# EAGLE design VIP (EAGLE 7.5.0)
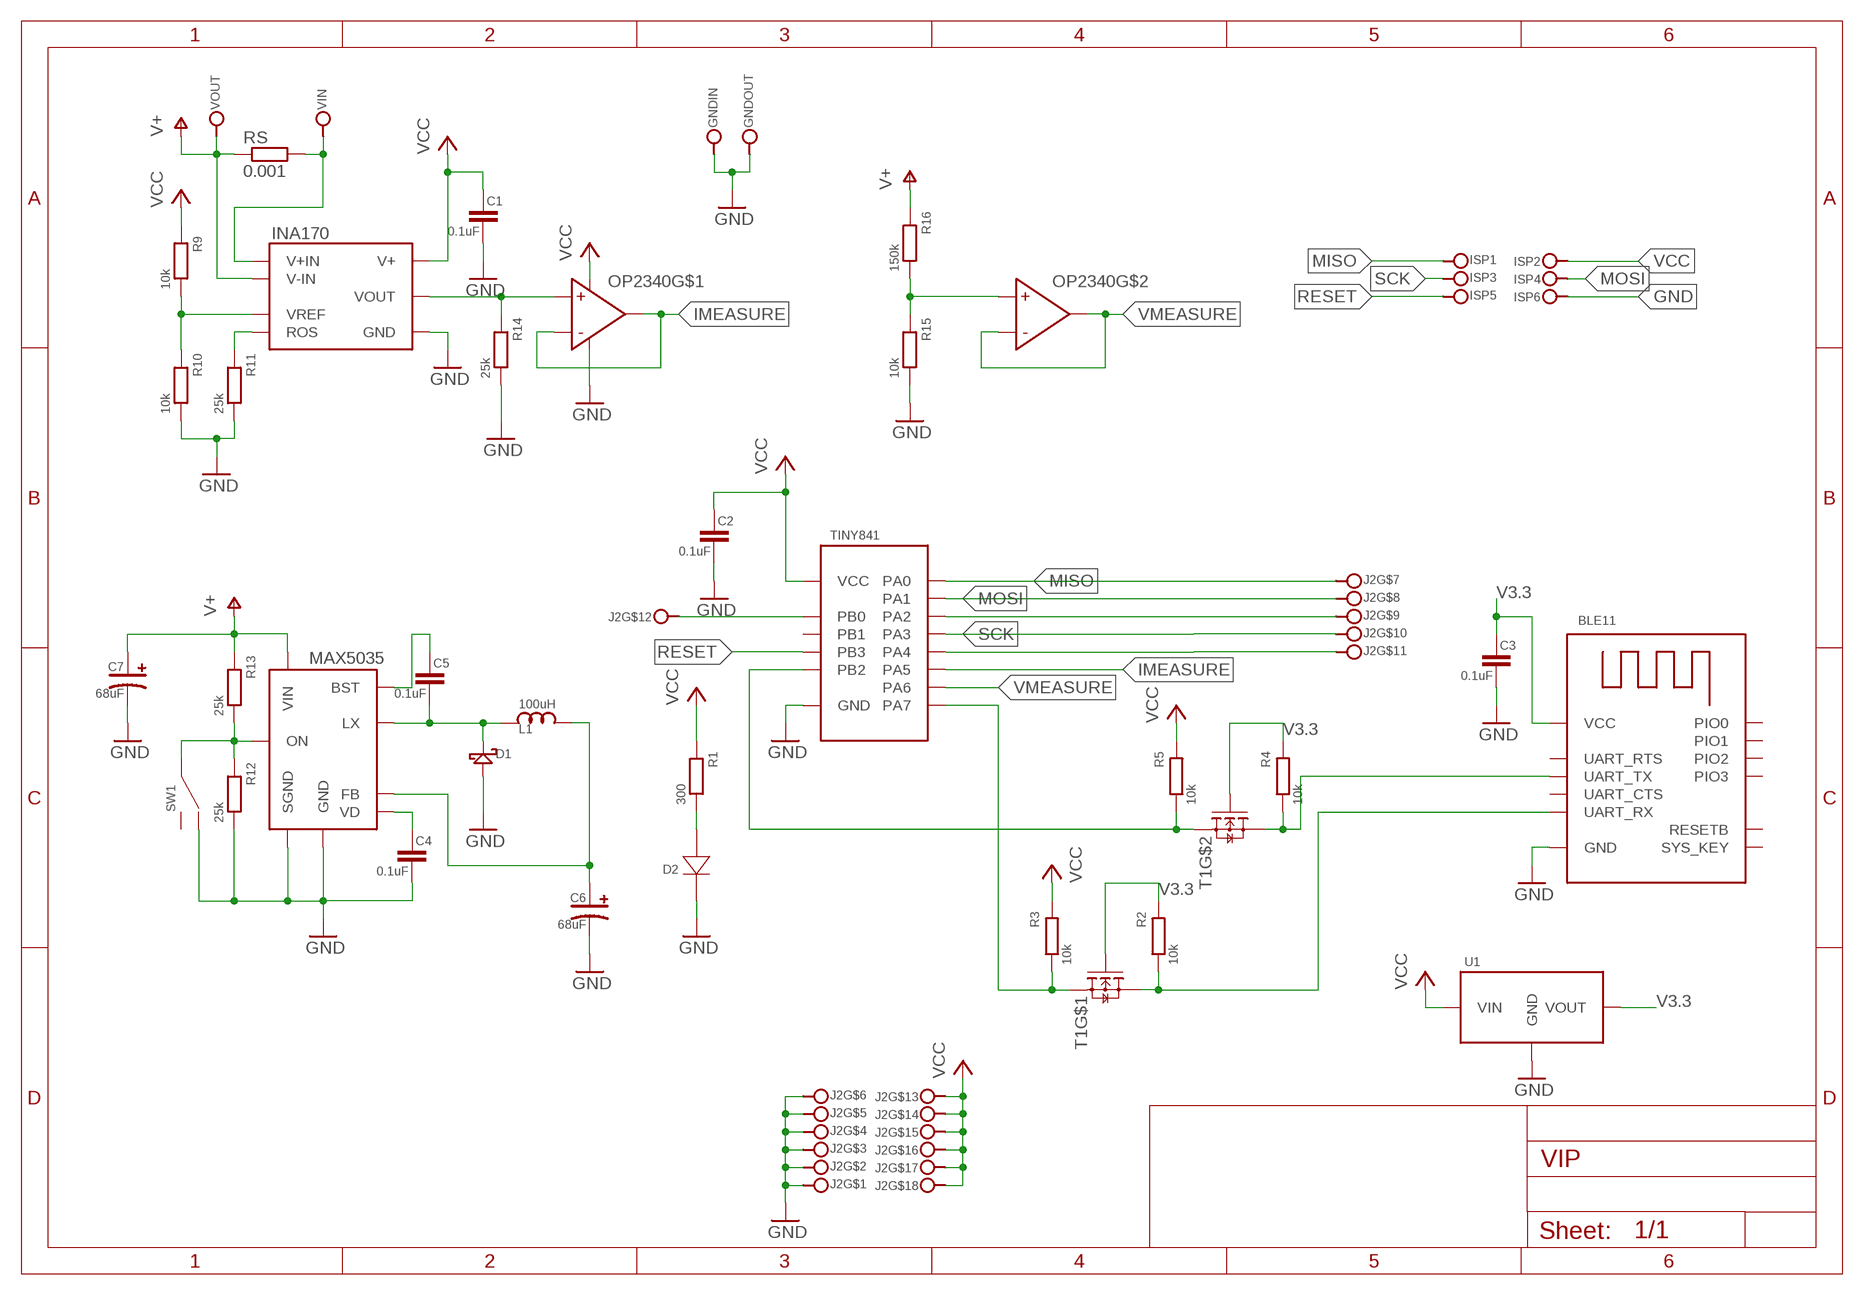
[diagram p0: schematic, sheet 1]

## Parts
BLE11  HM-17BLE  [HM17BLE]
C1  0.1uF  C_SMD  [0603L]
C2  0.1uF  C_SMD  [0603L]
C3  0.1uF  C_SMD  [0603L]
C4  0.1uF  C_SMD  [0603L]
C5  0.1uF  C_SMD  [0603L]
C6  68uF  ECAP_SMD6.3MM  [RAD6.3MM]
C7  68uF  ECAP_SMD12.5MM  [RAD12.5MM]
D1  SCHOTTKY  [DO-214AA]
D2  SINGLELEDKP-3216SRC-PRV  [LED3.2X1.6MM]
GNDIN  POWERTAB  [POWER8X10MM]
GNDOUT  POWERTAB  [POWER8X10MM]
INA170  INA170  [INA170]
ISP  CON254_6WAY254-2X3-EDGE  [CON254MM08_2X3_EDGE]
J2  CON254_18WAY3X6  [CON254MM08_3X6]
L1  100uH  L_SMD8040  [SRN8040]
MAX5035  MAX5035  [NSOIC-8]
OP2340  OPA2340  [SO-8]
R1  300  R_SMD  [0603L]
R2  10k  R_SMD  [0603L]
R3  10k  R_SMD  [0603L]
R4  10k  R_SMD  [0603L]
R5  10k  R_SMD  [0603L]
R9  10k  R_SMD  [0603L]
R10  10k  R_SMD  [0603L]
R11  25k  R_SMD  [0603L]
R12  25k  R_SMD  [0603L]
R13  25k  R_SMD  [0603L]
R14  25k  R_SMD  [0603L]
R15  10k  R_SMD  [0603L]
R16  150k  R_SMD  [0603L]
RS  0.001  R-EU_3921[1052METRIC]  [3921[1052METRIC]]
SW1  SWITCH-1P2T  [JS102011]
T1  2N7002  [SOT-563]
TINY841  ATTINY841  [SOIC14]
U1  L78L33A  [SOT-89]
VIN  POWERTAB  [POWER8X10MM]
VOUT  POWERTAB  [POWER8X10MM]

## Nets
GND: BLE11.P$12(GND) C1.P$2 C2.P$2 C3.P$2 C4.P$2 C6.P$2 C7.P$2 D1.P$2(A) D2.P$2(K) GNDIN.P$1(J$1) GNDOUT.P$1(J$1) INA170.P$4(GND) ISP.P$6 J2.P$1 J2.P$2 J2.P$3 J2.P$4 J2.P$5 J2.P$6 MAX5035.P$3(SGND) MAX5035.P$6(GND) OP2340.P$4(V-) R10.P$2 R11.P$2 R12.P$2 R14.P$2 R15.P$2 SW1.P$1 TINY841.P$14(GND) U1.P$2(GND)
IMEASURE: OP2340.P$1(OUT) OP2340.P$2(IN-) TINY841.P$8(PA5)
MISO: ISP.P$1 J2.P$7 TINY841.P$13(PA0)
MOSI: ISP.P$4 J2.P$8 TINY841.P$12(PA1)
N$1: MAX5035.P$5(ON) R12.P$1 R13.P$2 SW1.P$2
N$3: INA170.P$6(VOUT) OP2340.P$3(IN+) R14.P$1
N$4: INA170.P$5(ROS) R11.P$1
N$5: INA170.P$3(VREF) R9.P$2 R10.P$1
N$6: C4.P$1 MAX5035.P$2(VD)
N$7: INA170.P$2(V+IN) RS.P$2 VIN.P$1(J$1)
N$8: C5.P$2 D1.P$1(C) L1.P$1 MAX5035.P$8(LX)
N$9: C5.P$1 MAX5035.P$1(BST)
N$10: J2.P$9 TINY841.P$11(PA2)
N$11: OP2340.P$5(IN+) R15.P$1 R16.P$2
N$12: C6.P$1 L1.P$2 MAX5035.P$4(FB)
N$13: J2.P$11 TINY841.P$9(PA4)
N$14: D2.P$1(A) R1.P$2
N$16: J2.P$12 TINY841.P$2(PB0)
N$17: R3.P$2 T1.P$4(S) TINY841.P$6(PA7)
N$19: BLE11.P$2(UART_TX) R4.P$2 T1.P$6(D)
N$21: BLE11.P$4(UART_RX) R2.P$2 T1.P$3(D)
RESET: ISP.P$5 TINY841.P$4(PB3)
SCK: ISP.P$3 J2.P$10 TINY841.P$10(PA3)
TOAT: R5.P$2 T1.P$1(S) TINY841.P$5(PB2)
V3.3: BLE11.P$9(VCC) C3.P$1 R2.P$1 R4.P$1 T1.P$2(G) T1.P$5(G) U1.P$1(VOUT)
V+: C7.P$1 INA170.P$1(V-IN) MAX5035.P$7(VIN) R13.P$1 R16.P$1 RS.P$1 VOUT.P$1(J$1)
VCC: C1.P$1 C2.P$1 INA170.P$8(V+) ISP.P$2 J2.P$13 J2.P$14 J2.P$15 J2.P$16 J2.P$17 J2.P$18 OP2340.P$8(V+) R1.P$1 R3.P$1 R5.P$1 R9.P$1 TINY841.P$1(VCC) U1.P$3(VIN)
VMEASURE: OP2340.P$6(IN-) OP2340.P$7(OUT) TINY841.P$7(PA6)
Unconnected: BLE11.P$1(UART_RTS) BLE11.P$3(UART_CTS) BLE11.P$8(SYS_KEY) BLE11.P$11(RESETB) BLE11.P$13(PIO3) BLE11.P$14(PIO2) BLE11.P$15(PIO1) BLE11.P$16(PIO0) SW1.P$3 TINY841.P$3(PB1)

## Library data of the parts
BLE11 = Shields:HM-17BLE
C1-C5 = RLC:C_SMD
C6 C7 = RLC:ECAP_SMD
D1 = Semiconductors:SCHOTTKY
D2 = OptoElectronics:SINGLELED
GNDIN GNDOUT VIN VOUT = Connectors:POWERTAB
INA170 = VIP:INA170
ISP = Connectors:CON254_6WAY
J2 = Connectors:CON254_18WAY
L1 = RLC:L_SMD
MAX5035 = Power:MAX5035
OP2340 = Semiconductors:OPA2340
R1-R5 R9-R16 = RLC:R_SMD
RS = rcl:R-EU_: RESISTOR, European symbol
SW1 = Switches:SWITCH-1P2T
T1 = Semiconductors:2N7002
TINY841 = MCU:ATTINY841
U1 = Power:L78L33A

## Board
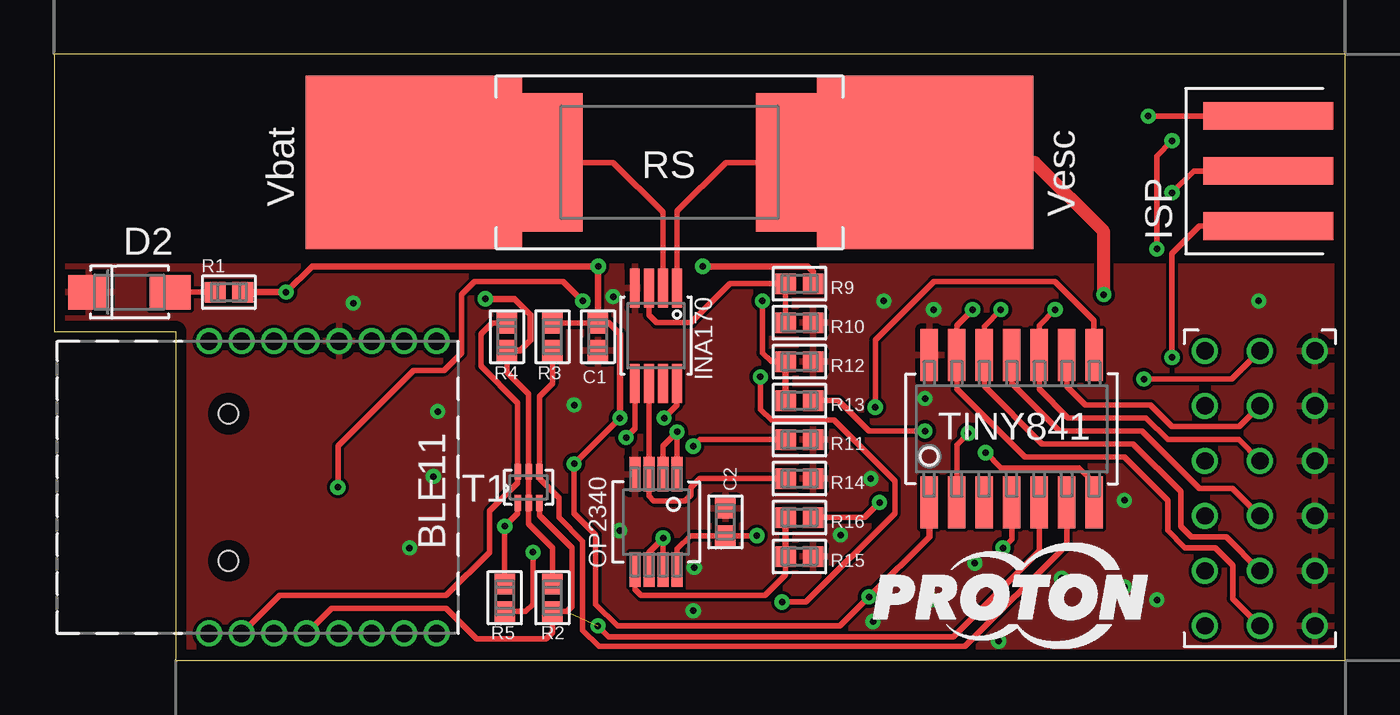
[diagram p1: board, top side]
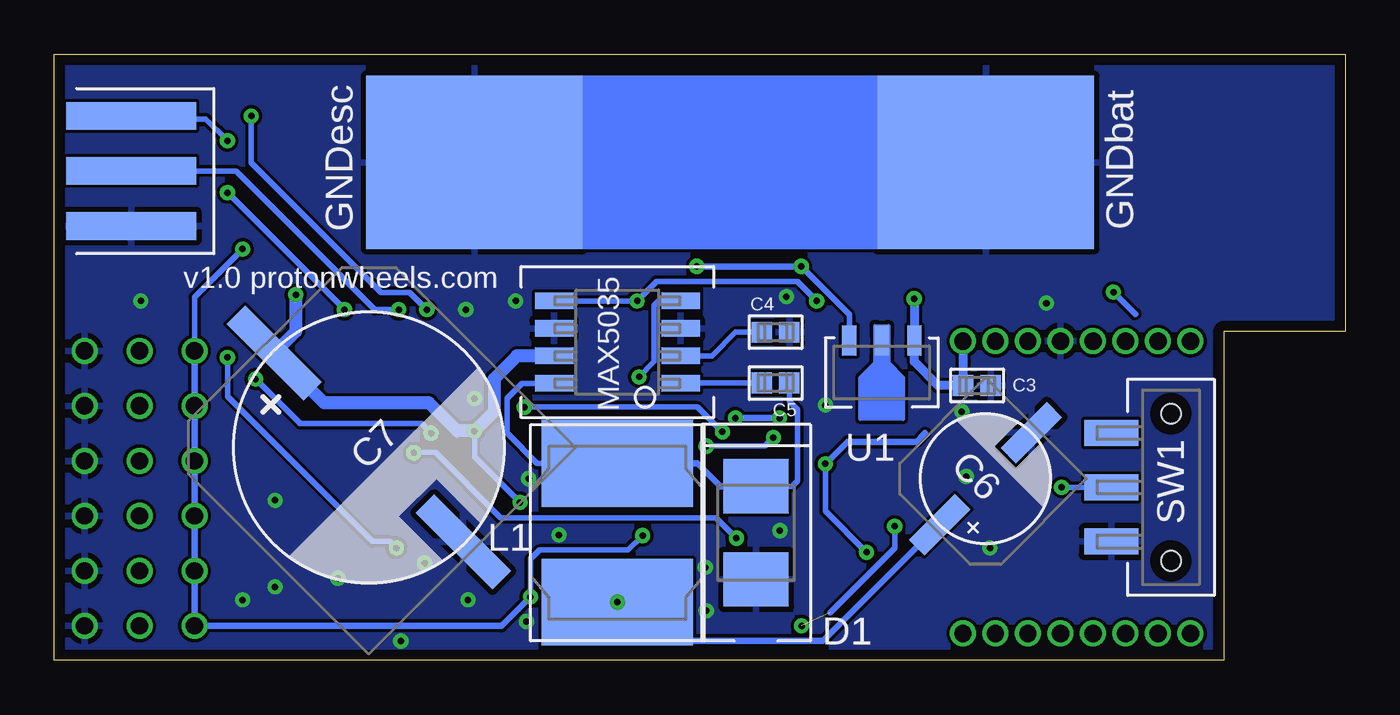
[diagram p2: board, bottom side, seen from below]

Size 59.6 x 28 mm. Coordinates in mm from the lower left corner, seen from the top.
Outline: 5.6,0 59.6,0 59.6,28 0,28 0,15.2 5.6,15.2 5.6,0
Copper layers (1*16): Top 0.035mm / dielectric 1.5mm / Bottom 0.035mm
Design rules "almiko": minimum track width 0.15mm, minimum drill 0.3mm, track to track 0.15mm, track to pad 0.15mm, pad to pad 0.15mm, via to via 0.15mm, smd to smd 0.15mm, copper to edge 0.5mm, drill to drill 0.35mm, minimum pad ring 0.2mm, minimum via ring 0.2mm, stop-mask expansion 0.1mm, vias tented up to drill 0.3mm, thermal gap 10mil

### Footprints (pad centres in the part's own frame; a part is rotated, then mirrored left to right if it is on the bottom)
HM17BLE = drill 0.8: P$1 -6.75,2.25; P$2 -6.75,0.75; P$3 -6.75,-0.75; P$4 -6.75,-2.25; P$5 -6.75,-3.75; P$6 -6.75,-5.25; P$7 -6.75,-6.75; P$8 -6.75,-8.25; P$9 6.75,-8.25; P$10 6.75,-6.75; P$11 6.75,-5.25; P$12 6.75,-3.75; P$13 6.75,-2.25; P$14 6.75,-0.75; P$15 6.75,0.75; P$16 6.75,2.25
0603L = smd 0.953 x 0.953: P$1 0.635,0; P$2 -0.635,0
RAD6.3MM = smd 1 x 3: P$1 0,3; P$2 0,-3
RAD12.5MM = smd 1.2 x 5: P$1 0,6.17; P$2 0,-6.17
DO-214AA = smd 2.5 x 3: P$1 -2.15,0; P$2 2.15,0
LED3.2X1.6MM = smd 1.9 x 1.6: P$1 -1.875,0; P$2 1.875,0
POWER8X10MM = smd 8 x 10: P$1 0,0
INA170 = smd 1.8 x 0.45: P$1 -2.2,0.975; P$2 -2.2,0.325; P$3 -2.2,-0.325; P$4 -2.2,-0.975; P$5 2.2,-0.975; P$6 2.2,-0.325; P$7 2.2,0.325; P$8 2.2,0.975
CON254MM08_2X3_EDGE = smd 6 x 1.27: P$1 0,2.54; P$3 0,0; P$5 0,-2.54 | smd 6 x 1.27 bottom: P$2 0,2.54; P$4 0,0; P$6 0,-2.54
CON254MM08_3X6 = drill 0.8: P$1 0,0; P$2 2.54,0; P$3 5.08,0; P$4 7.62,0; P$5 10.16,0; P$6 12.7,0; P$7 0,2.54; P$8 2.54,2.54; P$9 5.08,2.54; P$10 7.62,2.54; P$11 10.16,2.54; P$12 12.7,2.54; P$13 0,5.08; P$14 2.54,5.08; P$15 5.08,5.08; P$16 7.62,5.08; P$17 10.16,5.08; P$18 12.7,5.08
SRN8040 = smd 7 x 4: P$1 0,3.2; P$2 0,-3.2
NSOIC-8 = smd 1.778 x 0.762: P$1 -2.921,1.905; P$2 -2.921,0.635; P$3 -2.921,-0.635; P$4 -2.921,-1.905; P$5 2.921,-1.905; P$6 2.921,-0.635; P$7 2.921,0.635; P$8 2.921,1.905
SO-8 = smd 1.6 x 0.5: P$1 -2.2,0.975; P$2 -2.2,0.325; P$3 -2.2,-0.325; P$4 -2.2,-0.975; P$5 2.2,-0.975; P$6 2.2,-0.325; P$7 2.2,0.325; P$8 2.2,0.975
3921[1052METRIC] = smd 3 x 6.4: P$1 -5.5,0; P$2 5.5,0
JS102011 = smd 1.2 x 2.5: P$1 -2.5,2.75; P$2 0,2.75; P$3 2.5,2.75 | hole 0.9: 3.4,0; -3.4,0
SOT-563 = smd 0.72 x 0.3: P$1 -0.72,0.5; P$2 -0.72,0; P$3 -0.72,-0.5; P$4 0.72,-0.5; P$5 0.72,0; P$6 0.72,0.5
SOIC14 = smd 2.4 x 0.8: P$1 -3.4,3.81; P$2 -3.4,2.54; P$3 -3.4,1.27; P$4 -3.4,0; P$5 -3.4,-1.27; P$6 -3.4,-2.54; P$7 -3.4,-3.81; P$8 3.4,-3.81; P$9 3.4,-2.54; P$10 3.4,-1.27; P$11 3.4,0; P$12 3.4,1.27; P$13 3.4,2.54; P$14 3.4,3.81
SOT-89 = smd 1.4 x 0.65: P$1 -1.475,1.5; P$2 -1.475,0; P$3 -1.475,-1.5

### Placement (x,y rotation side)
BLE11  9.4,8 90 top
C1  25.1,14.95 90 top
C2  30.98,6.4 270 top
C3  17,12.7 180 bottom
C4  26.3,15.16 180 bottom
C5  26.3,12.81 180 bottom
C6  16.61,8.4 135 bottom
C7  45.08,9.84 45 bottom
D1  27.2,5.9 270 bottom
D2  3.48,17.01 180 top
GNDIN  16.6,23 90 bottom
GNDOUT  40.2,23 90 bottom
INA170  27.78,15 270 top
ISP  56.04,22.6 0 top
J2  58.2,1.6 90 top
L1  33.6,5.9 0 bottom
MAX5035  33.6,14.7 180 bottom
OP2340  27.78,6.4 270 top
R1  8.06,17.01 0 top
R2  23,2.9 90 top
R3  23,14.95 90 top
R4  20.9,14.95 270 top
R5  20.8,2.9 270 top
R9  34.4,17.4 0 top
R10  34.4,15.6 180 top
R11  34.4,10.2 180 top
R12  34.4,13.8 180 top
R13  34.4,12 0 top
R14  34.4,8.4 180 top
R15  34.4,4.8 180 top
R16  34.4,6.6 0 top
RS  28.4,23 180 top
SW1  8.05,8 90 bottom
T1  21.9,8 90 top
TINY841  44.2,10.7 90 top
U1  21.4,13.3 270 bottom
VIN  16.6,23 90 top
VOUT  40.2,23 90 top

### Tracks (layer width: path | path; a pad name or v marks a point on that pad's centre or on a via)
GND  (via drill 0.3)
  other vias: 25.8,16.8 37.7,8.4 38.3,16.6 40.6,16.2 40.2,12.1 26.1,6 29.5,2.3 29.55,4.3 36.3,5.8 37.8,1.8 40.5,2.8 42.5,4.5 46.5,3.8 43.6,0.9 49.4,3.4 50.9,2.8 49.4,7.4 17.7,11.5 17.5,8.5 16.4,5.2 13.8,16.5 55.6,16.6 24,11.8
  pour Top: 5.6,0 59.6,0 59.6,18.2 0,18.2 0,15.2 5.6,15.2
  pour Bottom: 5.6,0 59.6,0 59.6,28 0,28 0,15.2 5.6,15.2
IMEASURE  (via drill 0.3)
  Top 0.254: TINY841.P$8 48,15.7 46.2,17.5 40.6,17.5 37.9,14.8 v37.9,11.7 | OP2340.P$2 28.11,9.91 v28.76,10.55 OP2340.P$1
  Top 0.305: TINY841.P$8
  Bottom 0.254: v37.9,11.7 29.9,11.7 v28.76,10.55
MISO  (via drill 0.3)
  Top 0.254: J2.P$7 54.4,2.86 54.4,4.4 53.6,5.2 52.2,5.2 51.4,6 51.4,7.4 49.4,9.4 44.8,9.4 41.66,12.54 TINY841.P$13 41.66,15.46 v42.4,16.2 | v50.5,25.14 ISP.P$1
  Top 0.305: 55.9,25 ISP.P$1
  Bottom 0.254: v42.4,16.2 43.2,17 44.5,17 50.5,23 v50.5,25.14
MOSI  (via drill 0.3)
  Top 0.254: J2.P$8 54.1,5.7 52.5,5.7 52,6.2 52,7.8 49.8,10 45.6,10 42.93,12.67 TINY841.P$12 42.93,15.43 v43.7,16.2
  Bottom 0.254: v43.7,16.2 44.8,16.2 51.2,22.6 ISP.P$4
N$1  (via drill 0.3)
  Top 0.254: R12.P$1 33.1,13.8 32.7,14.2 v32.7,16.6 | v24.4,16.6 23.5,17.5 19.4,17.5 18.8,16.9 18.8,14.2 18,13.4 16.6,13.4 13.1,9.9 v13.1,8
  Top 0.305: R12.P$1 R13.P$2
  Bottom 0.254: v24.4,16.6 25.3,17.5 31.8,17.5 v32.7,16.6 MAX5035.P$5 | SW1.P$2 v13.1,8
N$3
  Top 0.254: INA170.P$6 OP2340.P$3 27.45,7.6 27.67,7.38 29.13,7.38 29.4,7.65 29.4,8 29.8,8.4 R14.P$1
N$4  (via drill 0.3)
  Top 0.254: INA170.P$5 26.8,10.7 v26.4,10.3 | v29.5,9.9 29.8,10.2 R11.P$1
  Bottom 0.254: v26.4,10.3 26.8,9.9 v29.5,9.9
N$5
  Top 0.254: INA170.P$3 27.45,15.95 27.8,15.6 29.4,15.6 31.2,17.4 R9.P$2 R10.P$1
N$6
  Bottom 0.254: MAX5035.P$2 29.23,14.06 28.14,15.16 C4.P$1
N$7
  Top 0.254: RS.P$2 25.8,23 28.11,20.69 INA170.P$2
  Top 0.406: VIN.P$1 RS.P$2
N$8
  Bottom 0.254: 27.7,8.05 25.55,8.05 25.3,8.3 25.3,11.6 25.66,11.96 C5.P$2 | L1.P$1 37.3,9.1 38.7,10.5 38.7,12.1 38,12.8 MAX5035.P$8
  Bottom 0.305: D1.P$1 27.7,8.05 28.85,8.05 29.9,9.1 L1.P$1
N$9
  Bottom 0.254: C5.P$1 30.66,12.81 MAX5035.P$1
N$10
  Top 0.254: TINY841.P$11 44.2,12.8 46.4,10.6 50.2,10.6 52.85,7.95 54.39,7.95 J2.P$9
N$11
  Top 0.254: OP2340.P$5 26.8,3.3 27.1,3 32.8,3 33.77,3.97 R15.P$1
  Top 0.305: R16.P$2 R15.P$1
N$12  (via drill 0.3)
  Top 0.254: v32.6,13.1 32.6,11.6 33.1,11.1 36,11.1 38.8,8.3 38.8,6.8 34.7,2.7 L1.P$2
  Bottom 0.254: MAX5035.P$4 31.7,16.6 31.9,16.4 31.9,13.8 v32.6,13.1 | L1.P$2 34.5,3.6 34.7,3.6 34.8,3.7 35.2,3.7
  Bottom 0.305: L1.P$2 31.8,0.9 24.11,0.9 C6.P$1
  other vias: 33.6,2.7
N$13
  Top 0.254: TINY841.P$9 46.74,12.66 47.6,11.8 50.6,11.8 51.6,10.8 54.7,10.8 J2.P$11
N$14
  Top 0.254: D2.P$1 R1.P$2
N$16  (via drill 0.3)
  Top 0.254: v50.3,13 54.36,13 J2.P$12 | TINY841.P$2 41.66,9.96 v42.2,10.5
  Bottom 0.254: v50.3,13 48.24,10.94 42.64,10.94 v42.2,10.5
N$17
  Top 0.254: R3.P$2 23,12.8 22.4,12.2 T1.P$4 22.4,8.4 23.3,7.5 23.3,6.6 24.4,5.5 24.4,1.4 25.15,0.65 42.05,0.65 46.74,5.34 TINY841.P$6
N$19
  Top 0.254: BLE11.P$2 10.4,3 18.1,3 20.1,5 20.1,6.9 21.4,8.2 T1.P$6 21.4,11.9 19.7,13.6 19.7,15.07 20.22,15.59 R4.P$2
N$21
  Top 0.254: T1.P$3 22.4,6.7 23.9,5.2 23.9,2.5 23.66,2.27 R2.P$2 23,1.3 22.7,1 19.5,1 18.1,2.4 12.8,2.4 BLE11.P$4
RESET  (via drill 0.3)
  Top 0.254: TINY841.P$4 44.2,5.6 v43.8,5.2 | ISP.P$5 52.86,20.06 51.6,18.8 v51.6,14
  Bottom 0.254: v43.8,5.2 44.1,5.5 44.9,5.5 51.6,12.2 v51.6,14
SCK  (via drill 0.3)
  Top 0.254: J2.P$10 54.68,10.2 51.4,10.2 50.4,11.2 46.8,11.2 45.47,12.53 TINY841.P$10 45.47,15.47 v46.2,16.2 | v51.6,21.6 52.6,22.6 ISP.P$3
  Bottom 0.254: v46.2,16.2 v51.6,21.6
TOAT  (via drill 0.3)  (1 unrouted)
  Top 0.254: R5.P$2 v20.8,6.2 21.4,6.8 T1.P$1 | TINY841.P$5 45.47,5.07 41.5,1.1 25.6,1.1 v25.1,1.6
  Bottom 0.254: v20.8,6.2 20.8,5.2 23.8,2.2
V3.3  (via drill 0.3)
  Top 0.254: R2.P$1 23,5.2 21.9,6.3 T1.P$2 T1.P$5 21.9,12.3 20.9,13.3 R4.P$1
  Top 0.305: v19.9,16.7 21.25,16.7 22,15.95 22,14.8 21.52,14.31 R4.P$1
  Bottom 0.406: v19.9,16.7 U1.P$1 19.9,13.8 18.8,12.7 C3.P$1 17.65,12.7 BLE11.P$9
V+  (via drill 0.3)
  Top 0.254: INA170.P$1 28.76,20.75 31,23 33.4,23 | R13.P$1 36.2,12 37.6,10.6 v40.2,10.6 | R16.P$1 37.4,6.6 v38.1,7.3
  Top 0.305: 33.4,23 RS.P$1
  Top 0.406: VOUT.P$1 33.4,23
  Top 0.61: VOUT.P$1 45.25,23 48.45,19.8 v48.45,16.89
  Bottom 0.254: v38.1,7.3 40.2,9.4 v40.2,10.6
  Bottom 0.61: v48.45,16.89 48.45,15.19 C7.P$1 47.13,11.9 42.3,11.9 41,10.6 v40.2,10.6 39.3,11.5 39.3,13 38.23,14.06 MAX5035.P$7
VCC  (via drill 0.3)  (1 unrouted)
  Top 0.254: OP2340.P$8 28.76,5.16 29.37,5.77 C2.P$1 v32.44,5.77 | v51.6,24 50.9,23.3 v50.9,19 | R5.P$1 21.77,2.27 22.1,2.6 v22.1,5 | R3.P$1 25.62,15.59 | v37.61,2.94 36.27,1.6 26,1.6 25,2.6 25,5.8 24,6.8 v24,9.08 v26.12,11.2 | INA170.P$8 28.76,11.8 v28.16,11.2
  Top 0.305: R9.P$1 35.04,17.97 34.8,18.2 v29.94,18.2 | v37.61,2.94 40.39,5.72 TINY841.P$1 | 25.11,15.59 v25.11,18.2 11.9,18.2 v10.71,17.01 R1.P$1 | v26.12,11.2 26.12,15.08 25.62,15.59 C1.P$1
  Bottom 0.254: v51.6,24 52.6,25 55.9,25 ISP.P$2 | v50.9,19 53.12,16.78 J2.P$18 | v22.1,5 24,6.9 v24,9.08 | v25.11,18.2 22.9,15.99 U1.P$3 | v32.44,5.77 33.1,5.1 37.2,5.1 37.61,4.69 v37.61,2.94
  Bottom 0.305: J2.P$18 J2.P$17 J2.P$16 J2.P$15 J2.P$14 J2.P$13 38.95,1.6 v37.61,2.94 | v28.16,11.2 v26.12,11.2 | v25.11,18.2 v29.94,18.2 | v10.71,17.01 9.7,16 | 19.4,10.5 19.8,10.1 22.98,10.1 v24,9.08
VMEASURE  (via drill 0.3)
  Top 0.254: v43,9.6 43.7,8.9 47.3,8.9 48.01,8.19 TINY841.P$7 | OP2340.P$7 v28.11,5.65 27.45,5 OP2340.P$6
  Bottom 0.254: v43,9.6 42,9.6 38.99,6.59 29.05,6.59 v28.11,5.65
(copper drawn outside any net)
  shapes: Bottom area x1

### Text on the board
tNames: Vbat | Vesc
bNames: GNDesc | GNDbat | v1.0 protonwheels.com